# EasyEDA Pro project 实战项目.eprj, schematic Schematic1
Board Name: Board1; Create Date: 2024-08-07
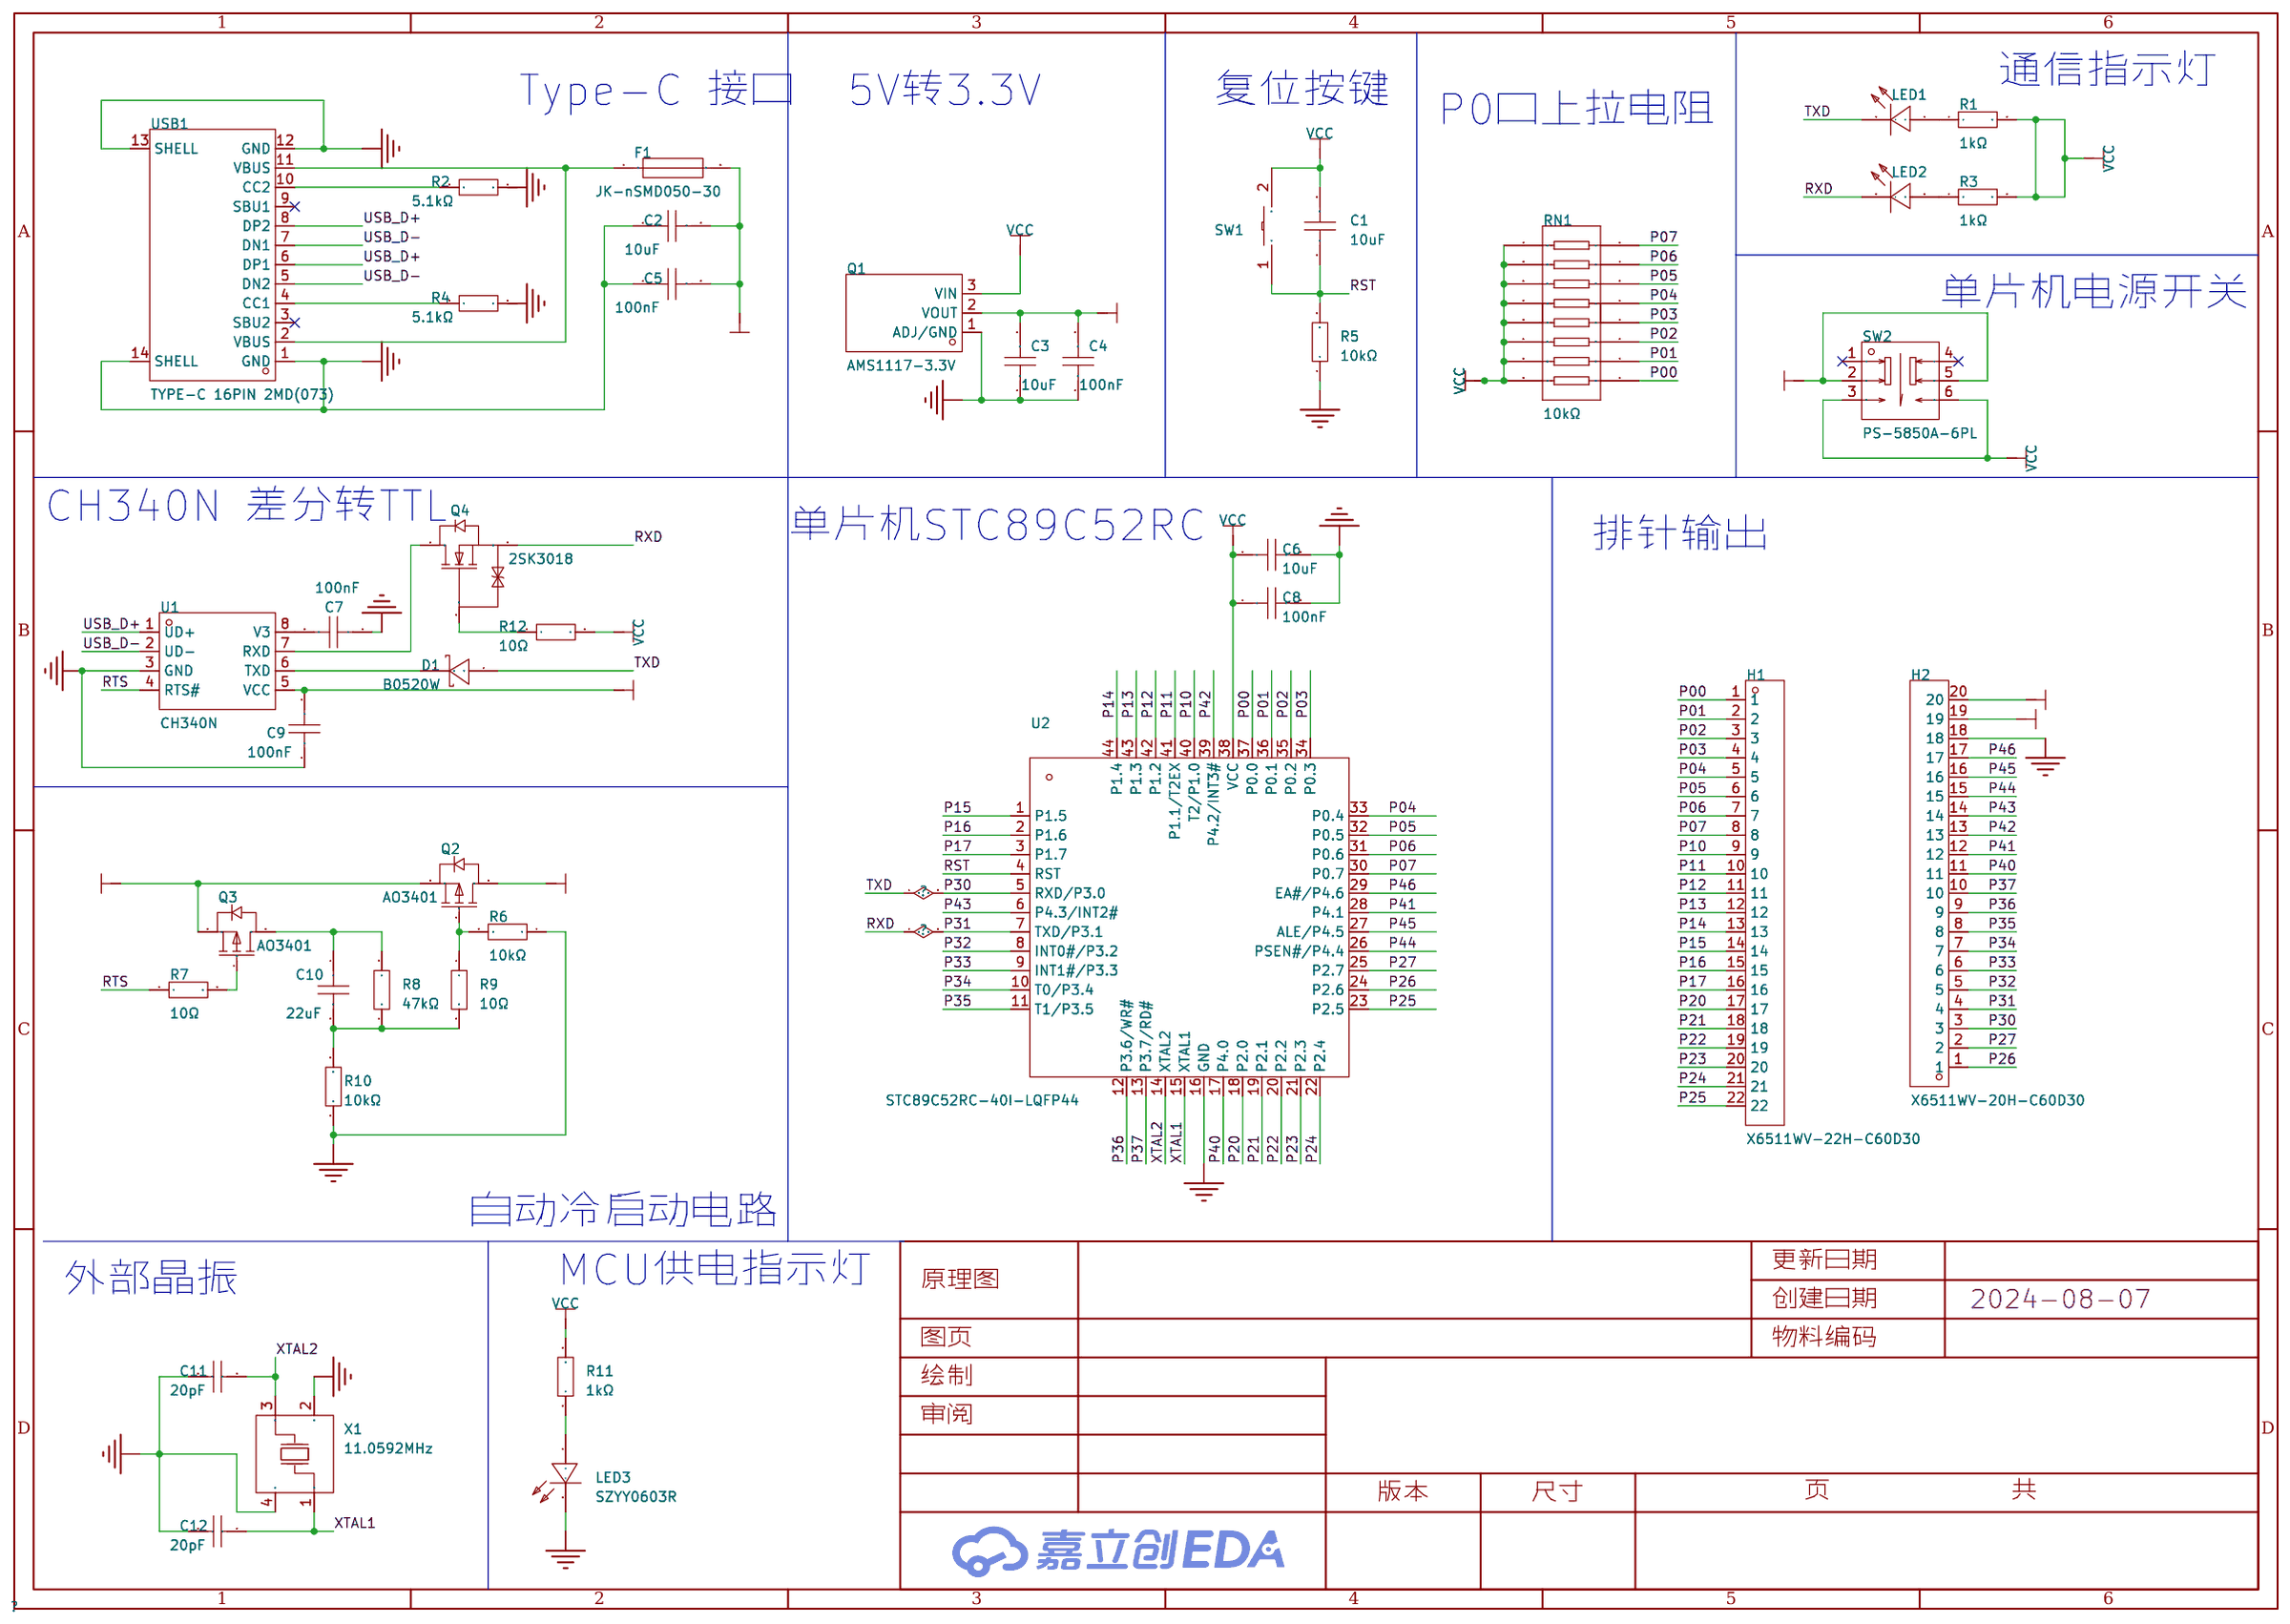
[diagram p0: schematic sheet]

## Parts
C1  10uF  [C0805]
C2  10uF  [C0805]
C3  10uF  [C0805]
C4  100nF  [C0603]
C5  100nF  [C0603]
C6  10uF  [C0805]
C7  100nF  [C0603]
C8  100nF  [C0603]
C9  100nF  [C0603]
C10  22uF  [C0805]
C11  20pF  [C0603]
C12  20pF  [C0603]
D1  B0520W  [SOD-123_L2.6-W1.7-LS3.5-RD]
F1  JK-nSMD050-30  [F1206]
H1  X6511WV-22H-C60D30  [HDR-TH_22P-P2.54-V-M]
H2  X6511WV-20H-C60D30  [HDR-TH_20P-P2.54-V-M]
LED1  SZYY0603R  [LED0603-R-RD]
LED2  SZYY0603R  [LED0603-R-RD]
LED3  SZYY0603R  [LED0603-R-RD]
Q1  AMS1117-3.3V  [SOT-89-3_L4.5-W2.5-P1.50-LS4.2-BR]
Q2  AO3401  [SOT-23-3_L2.9-W1.4-P1.90-LS2.6-BR]
Q3  AO3401  [SOT-23-3_L2.9-W1.4-P1.90-LS2.6-BR]
Q4  2SK3018  [SOT-23-3_L2.9-W1.4-P1.90-LS2.6-BR]
R1  1kΩ  [R0603]
R2  5.1kΩ  [R0402]
R3  1kΩ  [R0603]
R4  5.1kΩ  [R0402]
R5  10kΩ  [R0603]
R6  10kΩ  [R0603]
R7  10Ω  [R0402]
R8  47kΩ  [R0603]
R9  10Ω  [R0402]
R10  10kΩ  [R0603]
R11  1kΩ  [R0603]
R12  10Ω  [R0402]
RN1  10kΩ  [RES-ARRAY-SMD_0402-16P-L4.0-W1.6-BL]
SW1  TS-1101-C-W  [SW-SMD_L6.0-W3.3-LS8.0]
SW2  PS-5850A-6PL  [SW-TH_6P-L5.8-W5.8-P2.00-LS4.5-BL_1]
U1  CH340N  [SOP-8_L5.0-W4.0-P1.27-LS6.0-BL]
U2  STC89C52RC-40I-LQFP44  [LQFP-44_L10.0-W10.0-P0.80-LS12.0-BL]
USB1  TYPE-C 16PIN 2MD(073)  [USB-C-SMD_TYPE-C-6PIN-2MD-073]
X1  11.0592MHz  [CRYSTAL-SMD_4P-L5.0-W3.2-BL]

## Library data of the parts
C1-C3 C6 = CL21A106KAYNNNE_C15850: LCSC Part Name: 10uF ±10% 25V; Supplier Part: C15850; Manufacturer: SAMSUNG(三星); Manufacturer Part: CL21A106KAYNNNE; Supplier Footprint: 0805; JLCPCB Part Class: 基础库; Datasheet: https://atta.szlcsc.com/upload/public/pdf/source/20160218/1457707763339.pdf; Supplier: LCSC; Tolerance: ±10%; Voltage Rated: 25V; Temperature Coefficient: X5R
C4 C5 C7-C9 = CC0603KRX7R9BB104: LCSC Part Name: 100nF ±10% 50V; Supplier Part: C14663; Manufacturer: YAGEO(国巨); Supplier Footprint: 0603; JLCPCB Part Class: 基础库; Datasheet: https://atta.szlcsc.com/upload/public/pdf/source/20180910/C282072_33301C7F631E79921B82A8DAC6BCC5B3.pdf; Supplier: LCSC; Tolerance: ±10%; Voltage Rated: 50V; Temperature Coefficient: X7R
C10 = CL21A226MAQNNNE: LCSC Part Name: 22uF ±20% 25V; Supplier Part: C45783; Manufacturer: SAMSUNG(三星); Supplier Footprint: 0805; JLCPCB Part Class: 基础库; Datasheet: https://atta.szlcsc.com/upload/public/pdf/source/20160218/1457707763339.pdf; Supplier: LCSC; Tolerance: ±20%; Voltage Rated: 25V; Temperature Coefficient: X5R
C11 C12 = CL10C200JB8NNNC: LCSC Part Name: 20pF ±5% 50V; Supplier Part: C1648; Manufacturer: SAMSUNG(三星); Supplier Footprint: 0603; JLCPCB Part Class: 基础库; Datasheet: https://atta.szlcsc.com/upload/public/pdf/source/20160218/1457707763339.pdf; Supplier: LCSC; Tolerance: ±5%; Voltage Rated: 50V; Temperature Coefficient: C0G
D1 = B0520W_C5189256: Supplier Part: C5189256; Manufacturer: TWGMC(台湾迪嘉); Supplier Footprint: SOD-123; JLCPCB Part Class: 扩展库; Datasheet: https://atta.szlcsc.com/upload/public/pdf/source/20221012/F0D1432D6590E003997B40C6325B554B.pdf; Supplier: LCSC
F1 = JK-nSMD050-30: LCSC Part Name: 30V 500mA 1206自恢复; Supplier Part: C720075; Manufacturer: JK(金科); Supplier Footprint: 1206; JLCPCB Part Class: 扩展库; Datasheet: https://atta.szlcsc.com/upload/public/pdf/source/20200810/C720075_06AF2D4541537091880CC35F0EFB49F8.pdf; Supplier: LCSC; Operating Voltage (Max): 30V; Current Rating (Max): 100A; Hold Current: 500mA; Trip Current: 1A; Power Dissipation: 600mW; Resistance - Initial (Ri) (Min): 150mΩ; Resistance - Post Trip (R1) (Max): 300mΩ; Maximum Time to Trip: 100ms; Operating Temperature: -40℃~+85℃
H1 = X6511WV-22H-C60D30: LCSC Part Name: 1x22P 间距:2.54mm 方针; Supplier Part: C725954; Manufacturer: XKB Connection(中国星坤); Supplier Footprint: 插件,P=2.54mm; JLCPCB Part Class: 扩展库; Datasheet: https://atta.szlcsc.com/upload/public/pdf/source/20221108/2FDDF9C694C8EDC81165E23F2EAAE597.pdf; Supplier: LCSC; Pin Structure: 1x22P; Pitch: 2.54mm; Row Spacing: 2.54mm; Circluar Pins/Square Pins: 方针; Number of Rows: 单排; Number of Pins: 22P; Current Rating (Max): 3A; Voltage Rating (Max): 250V; Insulation Height: 2.5mm; Contact Material: 黄铜; Contact Plating: 金; Operating Temperature Range: -40℃~+105℃; Soldering Temperature(Max): 260℃; Color: 黑色
H2 = X6511WV-20H-C60D30: LCSC Part Name: 1x20P 间距:2.54mm 方针; Supplier Part: C725952; Manufacturer: XKB Connection(中国星坤); Supplier Footprint: 插件,P=2.54mm; JLCPCB Part Class: 扩展库; Datasheet: https://atta.szlcsc.com/upload/public/pdf/source/20221108/2FDDF9C694C8EDC81165E23F2EAAE597.pdf; Supplier: LCSC; Pin Structure: 1x20P; Pitch: 2.54mm; Row Spacing: 2.54mm; Circluar Pins/Square Pins: 方针; Number of Rows: 单排; Number of Pins: 20P; Current Rating (Max): 3A; Voltage Rating (Max): 250V; Insulation Height: 2.5mm; Contact Material: 黄铜; Contact Plating: 金; Operating Temperature Range: -40℃~+105℃; Soldering Temperature(Max): 260℃; Color: 黑色
LED1-LED3 = SZYY0603R: LCSC Part Name: 红灯; Supplier Part: C434419; Manufacturer: yongyu(永裕光电); Supplier Footprint: 0603; JLCPCB Part Class: 扩展库; Datasheet: https://atta.szlcsc.com/upload/public/pdf/source/20191204/C434419_0B955C1F73FF88449D9A795B6FF49070.pdf; Supplier: LCSC; Emitted Color: 红色; Power Dissipation: 40mW; Forward Current: 20mA; Dominant Wavelength: 615nm~630nm; Peak Wavelength: 645nm; Lens Color: 无色透明透镜; Viewing Angle: 120°; Operating Temperature: -40℃~+85℃
Q1 = AMS1117-3.3V_C5120796: LCSC Part Name: 输入18V 输出3.3V 1A; Supplier Part: C5120796; Manufacturer: MSKSEMI(美森科); Supplier Footprint: SOT-89; JLCPCB Part Class: 扩展库; Datasheet: https://atta.szlcsc.com/upload/public/pdf/source/20220727/5E62EAC46FFFF83337622C0FBE1B6BF8.pdf; Supplier: LCSC; Output Type: 固定; Maximum Input Voltage: 18V; Output Voltage: 3.3V; MAX Output Current: 1A; Dropout Voltage: 1.4V@(1A); standby current: 12mA; Operating Temperature: 0℃~+125℃; Output Polarity: 正极; Number of Outputs: 1
Q2 Q3 = AO3401_C727156: LCSC Part Name: 1个P沟道 耐压:30V 电流:4.2A; Supplier Part: C727156; Manufacturer: TWGMC(台湾迪嘉); Supplier Footprint: SOT-23; JLCPCB Part Class: 扩展库; Datasheet: https://atta.szlcsc.com/upload/public/pdf/source/20200827/C727156_6E081BBEEFBC6B8FEE164CB196B0AF30.pdf; Supplier: LCSC; Type: 1个P沟道; Drain Source Voltage (Vdss): 30V; Continuous Drain Current (Id): 4.2A; Power Dissipation (Pd): 350mW; Drain Source On Resistance (RDS(on)@Vgs,Id): 65mΩ@10V,4.2A; Gate Threshold Voltage (Vgs(th)@Id): 1.3V@250uA
Q4 = 2SK3018: Supplier Part: C727148; Manufacturer: TWGMC(台湾迪嘉); Supplier Footprint: SOT-23; JLCPCB Part Class: 扩展库; Datasheet: https://atta.szlcsc.com/upload/public/pdf/source/20200827/C727148_2301BBDB89FCE642A4A39ABEF7075607.pdf; Supplier: LCSC
R1 R3 R11 = 0603WAF1001T5E: LCSC Part Name: 1kΩ ±1% 100mW 厚膜电阻; Supplier Part: C21190; Manufacturer: UNI-ROYAL(厚声); Supplier Footprint: 0603; JLCPCB Part Class: 基础库; Datasheet: https://atta.szlcsc.com/upload/public/pdf/source/20200306/C422600_1E6D84923E4A46A82E41ADD87F860B5C.pdf; Supplier: LCSC; Type: 厚膜电阻; Tolerance: ±1%; Power(Watts): 100mW; Overload Voltage (Max): 75V; Temperature Coefficient: ±100ppm/℃; Operating Temperature Range: -55℃~+155℃
R2 R4 = 0402WGF5101TCE: LCSC Part Name: 5.1kΩ ±1% 62.5mW 厚膜电阻; Supplier Part: C25905; Manufacturer: UNI-ROYAL(厚声); Supplier Footprint: 0402; JLCPCB Part Class: 基础库; Datasheet: https://atta.szlcsc.com/upload/public/pdf/source/20200306/C422600_1E6D84923E4A46A82E41ADD87F860B5C.pdf; Supplier: LCSC; Type: 厚膜电阻; Tolerance: ±1%; Power(Watts): 62.5mW; Overload Voltage (Max): 50V; Temperature Coefficient: ±100ppm/℃; Operating Temperature Range: -55℃~+155℃
R5 R6 R10 = 0603WAF1002T5E: LCSC Part Name: 厚膜电阻 10kΩ ±1% 100mW; Supplier Part: C25804; Manufacturer: UNI-ROYAL(厚声); Supplier Footprint: 0603; JLCPCB Part Class: 基础库; Datasheet: https://atta.szlcsc.com/upload/public/pdf/source/20200306/C422600_1E6D84923E4A46A82E41ADD87F860B5C.pdf; Supplier: LCSC; Type: 厚膜电阻; Tolerance: ±1%; Power(Watts): 100mW; Overload Voltage (Max): 75V; Temperature Coefficient: ±100ppm/℃; Operating Temperature Range: -55℃~+155℃
R7 R9 R12 = 0402WGF100JTCE: LCSC Part Name: 10Ω ±1% 62.5mW 厚膜电阻; Supplier Part: C25077; Manufacturer: UNI-ROYAL(厚声); Supplier Footprint: 0402; JLCPCB Part Class: 基础库; Datasheet: https://atta.szlcsc.com/upload/public/pdf/source/20200306/C422600_1E6D84923E4A46A82E41ADD87F860B5C.pdf; Supplier: LCSC; Type: 厚膜电阻; Tolerance: ±1%; Power(Watts): 62.5mW; Overload Voltage (Max): 50V; Temperature Coefficient: ±200ppm/℃; Operating Temperature Range: -55℃~+155℃
R8 = 0603WAF4702T5E: LCSC Part Name: 47kΩ ±1% 100mW 厚膜电阻; Supplier Part: C25819; Manufacturer: UNI-ROYAL(厚声); Supplier Footprint: 0603; JLCPCB Part Class: 基础库; Datasheet: https://atta.szlcsc.com/upload/public/pdf/source/20200306/C422600_1E6D84923E4A46A82E41ADD87F860B5C.pdf; Supplier: LCSC; Type: 厚膜电阻; Tolerance: ±1%; Power(Watts): 100mW; Overload Voltage (Max): 75V; Temperature Coefficient: ±100ppm/℃; Operating Temperature Range: -55℃~+155℃
RN1 = 16P8WGJ0103T4E: LCSC Part Name: 10kΩ ±5%; Supplier Part: C61520; Manufacturer: UNI-ROYAL(厚声); Supplier Footprint: 0402x8; JLCPCB Part Class: 扩展库; Datasheet: https://atta.szlcsc.com/upload/public/pdf/source/20191224/C474318_2527498AE30E813171187CCD28401A71.pdf; Supplier: LCSC; Number of Resistors: 8; Tolerance: ±5%; Power(Watts): 62.5mW; Temperature Coefficient: ±200ppm/℃; Number of Pins: 16
SW1 = TS-1101-C-W: LCSC Part Name: 6*3.6*2.5mm 立贴 轻触开关; Supplier Part: C318938; Manufacturer: XKB Connectivity(中国星坤); Supplier Footprint: SMD; JLCPCB Part Class: 扩展库; Datasheet: https://atta.szlcsc.com/upload/public/pdf/source/20200227/C318938_C2E53B1EEDE37D980A33616AC086DE53.pdf; Supplier: LCSC; Circuit: 单刀单掷; Actuator Style: 矩形按钮; Operating Force: 260gf; Mounting Style: 立贴; Switch Length: 6mm; Switch Width: 3.6mm; Switch Height: 2.5mm; Strike Gundam: 不带; Contact Current: 50mA; Voltage Rating (DC): 12V; Actuator/Cap Color: 白色带淡绿; With Lamp: 无; Mechanical Life: 5万次; Operating Temperature: -30℃~+85℃
SW2 = PS-5850A-6PL: LCSC Part Name: 自锁按键开关; Supplier Part: C963201; Manufacturer: G-Switch(品赞); Supplier Footprint: 插件; JLCPCB Part Class: 扩展库; Datasheet: https://atta.szlcsc.com/upload/public/pdf/source/20201201/C963201_9229C247AC907A82E381B4EE0BC1DEDE.pdf; Supplier: LCSC; Circuit: 双刀双掷; Self Lock / No Lock: 自锁; Actuator Style: 矩形柱塞; Mounting Style: 直插; Contact Current: 500mA; Voltage Rating (DC): 30V; Insulation Resistance: 100MΩ; Actuator/Cap Color: 黑色; Pin Style: PC引脚; Operating Temperature: -25℃~+65℃; Mechanical Life: 10万次
U1 = CH340N_C506813: LCSC Part Name: USB转串口芯片 CH340; Supplier Part: C506813; Manufacturer: WCH(南京沁恒); Supplier Footprint: SOP-8; JLCPCB Part Class: 扩展库; Datasheet: https://atta.szlcsc.com/upload/public/pdf/source/20200819/C84681_ADBED554CE321879DBD6B1D06488689C.pdf; Supplier: LCSC
U2 = STC89C52RC-40I-LQFP44: Supplier Part: C8707; Manufacturer: STC(宏晶); Supplier Footprint: LQFP-44(10x10); JLCPCB Part Class: 扩展库; Datasheet: https://atta.szlcsc.com/upload/public/pdf/source/20131218/1457706663573.pdf; Supplier: LCSC; CPU Core: 51系列; Program Storage Size: 8KB; RAM Size: 512Byte; GPIO Ports Number: 39; Operating Voltage Range: 3.3V~5.5V; Program Memory Type: FLASH; Operating Temperature Range: -40℃~+85℃; 16Bit Timer: 3; UART/USART: 1; Peripheral/Function: 看门狗; Watchdog: 有
USB1 = TYPE-C 16PIN 2MD(073): LCSC Part Name: Type-C 母 卧贴; Supplier Part: C2765186; Manufacturer: SHOU HAN(首韩); Supplier Footprint: SMD; JLCPCB Part Class: 扩展库; Datasheet: https://atta.szlcsc.com/upload/public/pdf/source/20211123/39B17C16241EAC15C5E277BDA434118E.pdf; Supplier: LCSC; Connector Type: Type-C; Gender: 母; Number of Ports: 1; Number of Contacts: 16P; Mounting Style: 卧贴; Current Rating - Power (Max): 5A; Operating Temperature Range: -25℃~+85℃
X1 = TXM11.059M0004503LDCDO00T: LCSC Part Name: 11.0592MHz ±20ppm 20pF; Supplier Part: C362357; Manufacturer: YJX(雅晶鑫); Supplier Footprint: SMD5032-4P; JLCPCB Part Class: 扩展库; Datasheet: https://atta.szlcsc.com/upload/public/pdf/source/20190124/C362357_79AA44C3BCE26F730BD469CF609EF204.pdf; Supplier: LCSC; Crystal Type: 贴片晶振; Normal temperature Frequency Tolerance: ±20ppm; External load capacitor: 20pF; Frequency Stability(Full temperature range): ±20ppm; Equivalent Series Resistance (ESR): 80Ω; Operating Temperature: -40℃~+85℃

## Nets
3V3: C3.2 C4.2 H2.19 Q1.2(VOUT)
GND: C2.1 C3.1 C4.1 C5.1 C6.2 C7.1 C8.2 C9.1 C11.1 C12.1 H2.18 LED3.2(-) Q1.1(ADJ/GND) R2.2 R4.2 R5.1 R6.1 R10.1 U1.3(GND) U2.16(GND) USB1.1(GND) USB1.12(GND) USB1.13(SHELL) USB1.14(SHELL) X1.2(GND) X1.4(GND)
VCC: C1.2 C6.1 C8.1 H2.20 Q1.3(VIN) R1.2 R3.2 R11.2 R12.2 RN1.9 RN1.10 RN1.11 RN1.12 RN1.13 RN1.14 RN1.15 RN1.16 SW1.2 SW2.3 SW2.6 U2.38(VCC)
VCC_SW: Q2.3(D) SW2.2 SW2.5
VIN_5V: C2.2 C5.2 C9.2 F1.2 Q2.2(S) Q3.2(S) U1.5(VCC)
P00: H1.1 RN1.1 U2.37(P0.0)
P01: H1.2 RN1.2 U2.36(P0.1)
P02: H1.3 RN1.3 U2.35(P0.2)
P03: H1.4 RN1.4 U2.34(P0.3)
P04: H1.5 RN1.5 U2.33(P0.4)
P05: H1.6 RN1.6 U2.32(P0.5)
P06: H1.7 RN1.7 U2.31(P0.6)
P07: H1.8 RN1.8 U2.30(P0.7)
P10: H1.9 U2.40(T2/P1.0)
P11: H1.10 U2.41(P1.1/T2EX)
P12: H1.11 U2.42(P1.2)
P13: H1.12 U2.43(P1.3)
P14: H1.13 U2.44(P1.4)
P15: H1.14 U2.1(P1.5)
P16: H1.15 U2.2(P1.6)
P17: H1.16 U2.3(P1.7)
P20: H1.17 U2.18(P2.0)
P21: H1.18 U2.19(P2.1)
P22: H1.19 U2.20(P2.2)
P23: H1.20 U2.21(P2.3)
P24: H1.21 U2.22(P2.4)
P25: H1.22 U2.23(P2.5)
P26: H2.1 U2.24(P2.6)
P27: H2.2 U2.25(P2.7)
P30: D1.2 H2.3 LED1.2(-) U2.5(RXD/P3.0)
P31: H2.4 LED2.2(-) Q4.2(S) U2.7(TXD/P3.1)
P32: H2.5 U2.8(INT0#/P3.2)
P33: H2.6 U2.9(INT1#/P3.3)
P34: H2.7 U2.10(T0/P3.4)
P35: H2.8 U2.11(T1/P3.5)
P36: H2.9 U2.12(P3.6/WR#)
P37: H2.10 U2.13(P3.7/RD#)
P40: H2.11 U2.17(P4.0)
P41: H2.12 U2.28(P4.1)
P42: H2.13 U2.39(P4.2/INT3#)
P43: H2.14 U2.6(P4.3/INT2#)
P44: H2.15 U2.26(PSEN#/P4.4)
P45: H2.16 U2.27(ALE/P4.5)
P46: H2.17 U2.29(EA#/P4.6)
RST: C1.1 R5.2 SW1.1 U2.4(RST)
RTS: R7.1 U1.4(RTS#)
USB_D+: U1.1(UD+) USB1.6(DP1) USB1.8(DP2)
USB_D-: U1.2(UD-) USB1.5(DN2) USB1.7(DN1)
XTAL1: C12.2 U2.15(XTAL1) X1.1(OSC1)
XTAL2: C11.2 U2.14(XTAL2) X1.3(OSC2)
$1N354: R2.1 USB1.10(CC2)
$1N433: R4.1 USB1.4(CC1)
$1N470: F1.1 USB1.2(VBUS) USB1.11(VBUS)
$1N3518: LED3.1(+) R11.1
$1N3810: D1.1 U1.6(TXD)
$1N3814: Q4.3(D) U1.7(RXD)
$1N3822: C7.2 U1.8(V3)
$1N4053: LED1.1(+) R1.1
$1N4133: LED2.1(+) R3.1
$1N4735: C10.1 Q3.3(D) R8.2
$1N4750: C10.2 R8.1 R9.2 R10.2
$1N4828: Q3.1(G) R7.2
$1N5081: Q2.1(G) R6.2 R9.1
$1N9141: Q4.1(G) R12.1

Not connected (* = marked no-connect by the designer): SW2 1* 4*; USB1 3(SBU2)* 9(SBU1)*

## Notes on the sheet
- 通信指示灯
- Type-C 接口
- 5V转3.3V
- 复位按键
- P0口上拉电阻
- 单片机电源开关
- CH340N 差分转TTL
- 单片机STC89C52RC
- 排针输出
- 自动冷启动电路
- 外部晶振
- MCU供电指示灯
